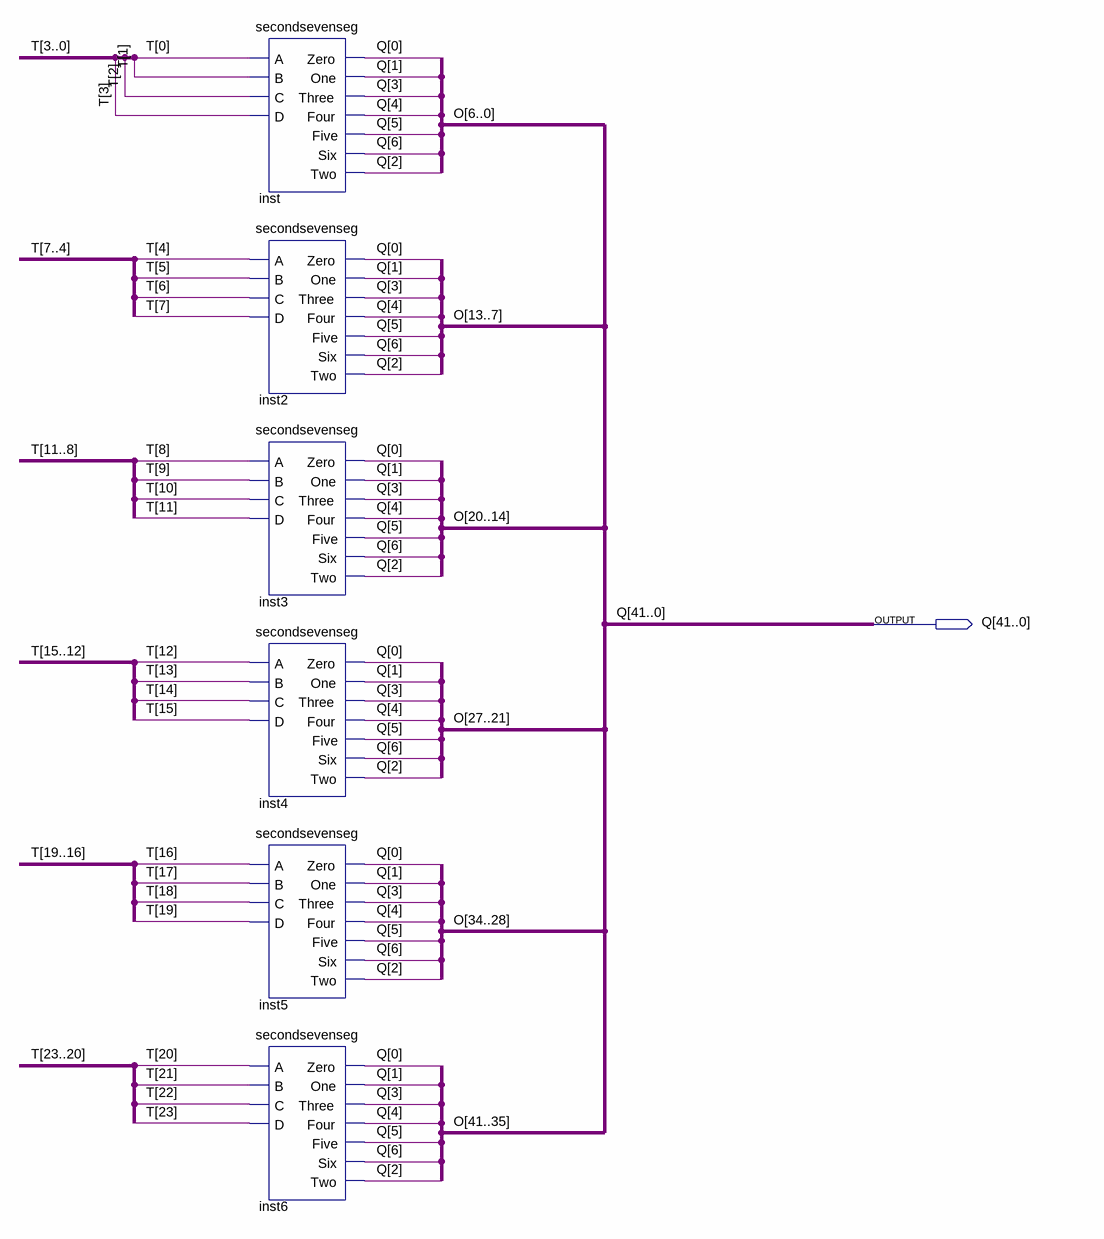
[diagram p0: schematic sheet]
// Quartus schematic rightpart.bdf as structural Verilog: 6 symbols, 1 pins
module rightpart (
  output [41:0] Q
);

  wire [23:0] T;

  secondsevenseg inst (
    .A(T[0]), .B(T[1]), .C(T[2]), .D(T[3]), .Zero(Q[0]), .One(Q[1]), .Three(Q[3]), .Four(Q[4]), .Five(Q[5]),
    .Six(Q[6]), .Two(Q[2]));
  secondsevenseg inst2 (
    .A(T[4]), .B(T[5]), .C(T[6]), .D(T[7]), .Zero(Q[0]), .One(Q[1]), .Three(Q[3]), .Four(Q[4]), .Five(Q[5]),
    .Six(Q[6]), .Two(Q[2]));
  secondsevenseg inst3 (
    .A(T[8]), .B(T[9]), .C(T[10]), .D(T[11]), .Zero(Q[0]), .One(Q[1]), .Three(Q[3]), .Four(Q[4]),
    .Five(Q[5]), .Six(Q[6]), .Two(Q[2]));
  secondsevenseg inst4 (
    .A(T[12]), .B(T[13]), .C(T[14]), .D(T[15]), .Zero(Q[0]), .One(Q[1]), .Three(Q[3]), .Four(Q[4]),
    .Five(Q[5]), .Six(Q[6]), .Two(Q[2]));
  secondsevenseg inst5 (
    .A(T[16]), .B(T[17]), .C(T[18]), .D(T[19]), .Zero(Q[0]), .One(Q[1]), .Three(Q[3]), .Four(Q[4]),
    .Five(Q[5]), .Six(Q[6]), .Two(Q[2]));
  secondsevenseg inst6 (
    .A(T[20]), .B(T[21]), .C(T[22]), .D(T[23]), .Zero(Q[0]), .One(Q[1]), .Three(Q[3]), .Four(Q[4]),
    .Five(Q[5]), .Six(Q[6]), .Two(Q[2]));
endmodule
